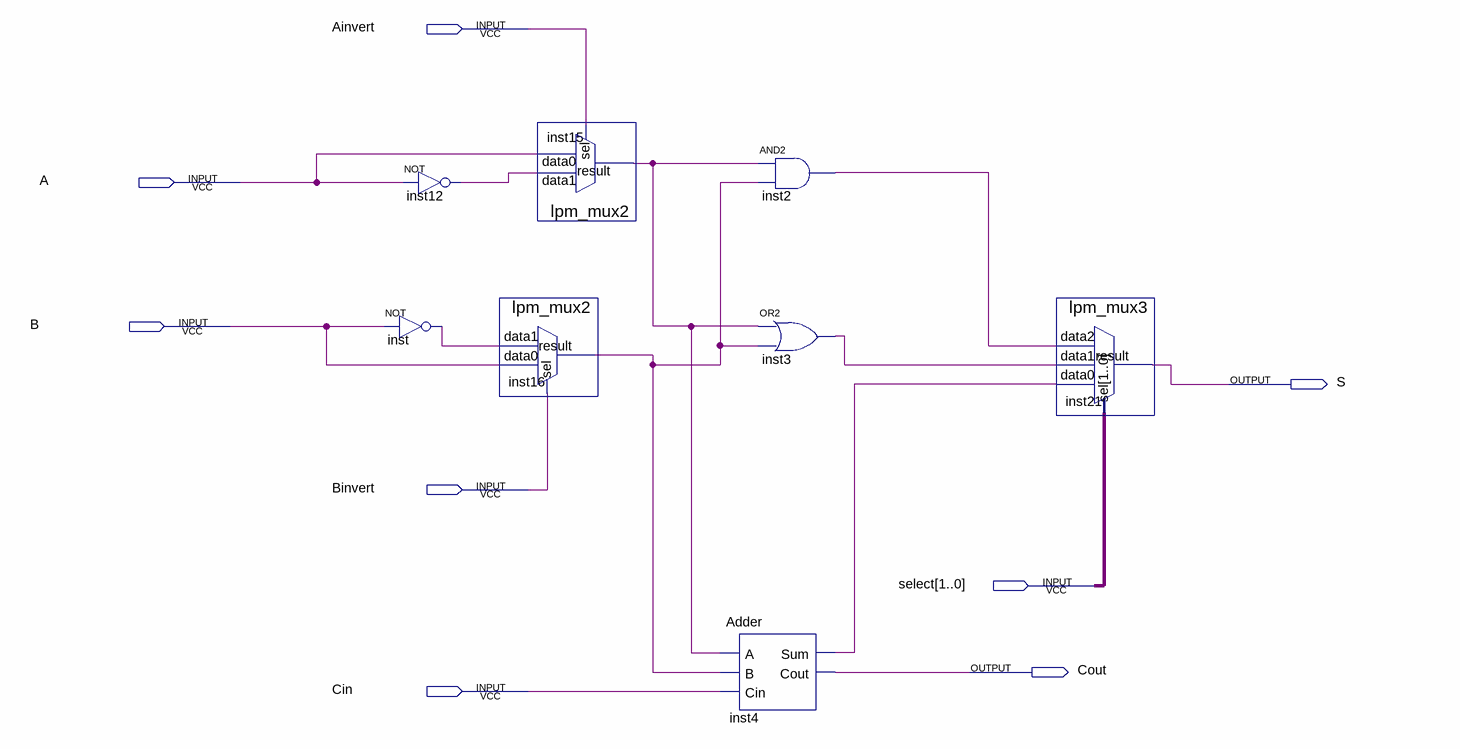
[diagram p0: schematic sheet]
// Quartus schematic ULA.bdf as structural Verilog: 8 symbols, 8 pins
module ULA (
  input  Ainvert,
  input  A,
  input  B,
  input  Binvert,
  input  [1:0] select,
  input  Cin,
  output S,
  output Cout
);

  wire inst2_out, inst3_out, inst4_sum, inst12_out, inst15_result, inst16_result, inst_out;

  not inst (inst_out, B);
  not inst12 (inst12_out, A);
  lpm_mux2 inst15 (.data1(inst12_out), .data0(A), .sel(Ainvert), .result(inst15_result));
  lpm_mux2 inst16 (.data1(inst_out), .data0(B), .sel(Binvert), .result(inst16_result));
  and inst2 (inst2_out, inst15_result, inst16_result);
  or inst3 (inst3_out, inst15_result, inst16_result);
  Adder inst4 (.A(inst15_result), .B(inst16_result), .Cin(Cin), .Sum(inst4_sum), .Cout(Cout));
  lpm_mux3 inst21 (.data2(inst2_out), .data1(inst3_out), .data0(inst4_sum), .sel(select), .result(S));
endmodule
